# EAGLE design ACC_GYRO_SENSOR (EAGLE 7.1.0)
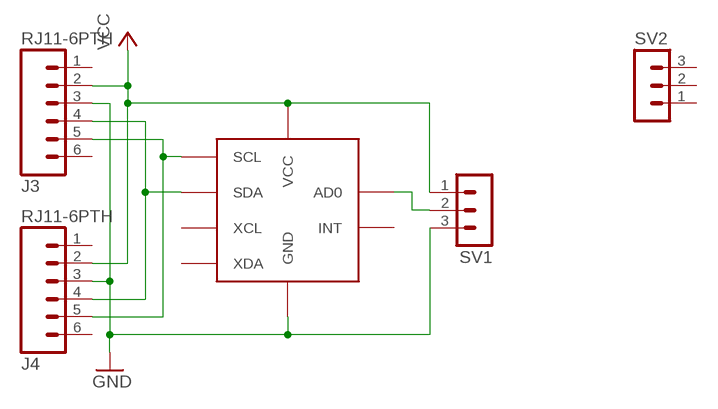
[diagram p0: schematic, sheet 1]

## Parts
J3  RJ11-6PTH  [RJ11-6]
J4  RJ11-6PTH  [RJ11-6]
SV1  MA03-1  [MA03-1]
SV2  MA03-1  [MA03-1]
U$1  GY-521  [GY-521]

## Nets
GND: J3.3 J4.3 SV1.3 U$1.GND
N$1: J3.4 J4.4 U$1.SDA
N$2: J3.5 J4.5 U$1.SCL
N$4: SV1.2 U$1.AD0
VCC: J3.2 J4.2 SV1.1 U$1.VCC
Unconnected: J3.1 J3.6 J4.1 J4.6 SV2.1 SV2.2 SV2.3 U$1.INT U$1.XCL U$1.XDA

## Library data of the parts
J3 J4 = BodyRockParts:RJ11-6: RJ11 Jack Simple 6 pin RJ11 jack. Commonly found on CAT3 devices and Microchip programmers. SKU: PRT-00132
SV1 SV2 = con-lstb:MA03-1: PIN HEADER; OC_FARNELL: unknown; OC_NEWARK: unknown
U$1 = GY-521:GY-521: MPU5060 Breakout Board -Standard pin header footprint

## Board
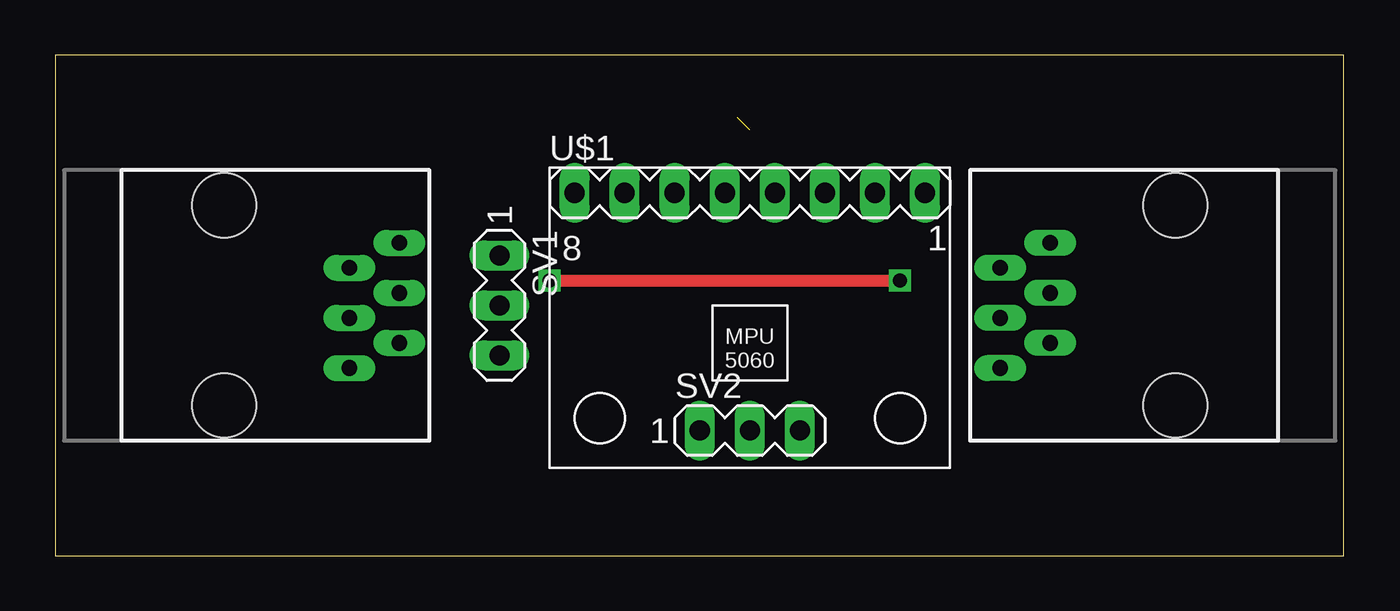
[diagram p1: board, top side]
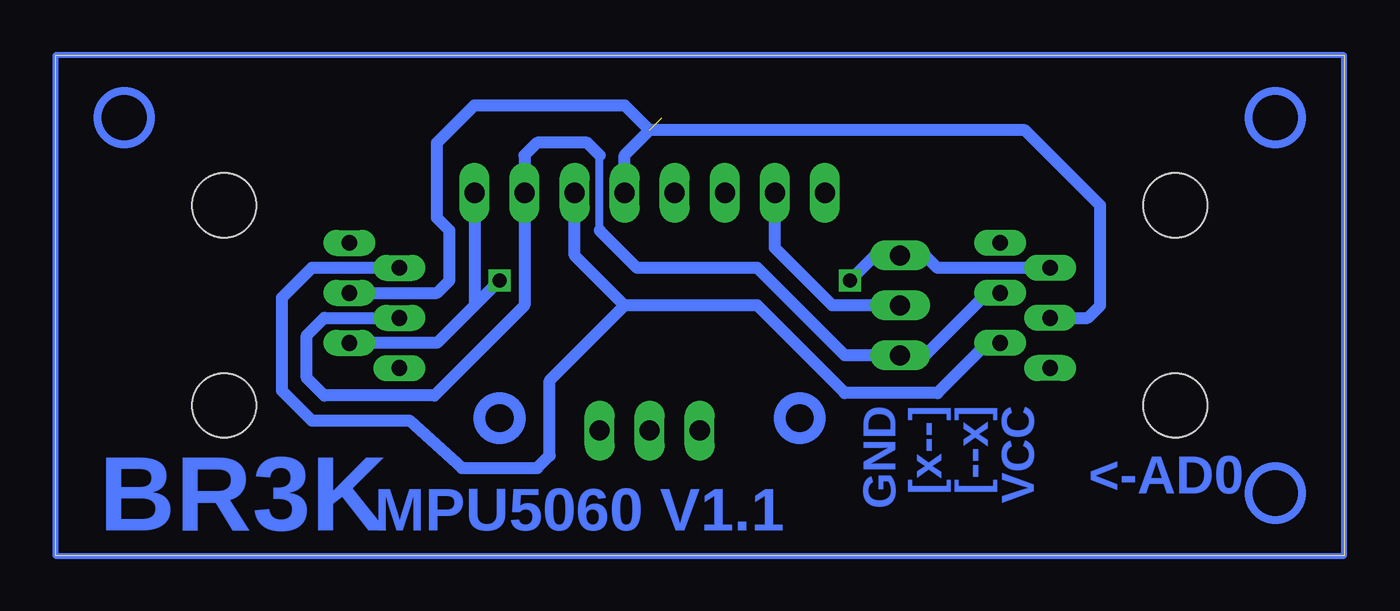
[diagram p2: board, bottom side, seen from below]

Size 65.39 x 25.39 mm. Coordinates in mm from the lower left corner, seen from the top.
Outline: 0,0 65.39,0 65.39,25.39 0,25.39 0,0
Copper layers (1*16): Top 0.035mm / dielectric 1.5mm / Bottom 0.035mm
Design rules "default *": minimum track width 10mil, minimum drill 24mil, track to track 12mil, track to pad 12mil, pad to pad 12mil, via to via 12mil, smd to smd 12mil, copper to edge 40mil, drill to drill 8mil, minimum pad ring 10mil, minimum via ring 8mil, stop-mask expansion 4mil, vias tented up to drill 0mil, thermal gap 10mil

### Footprints (pad centres in the part's own frame; a part is rotated, then mirrored left to right if it is on the bottom)
RJ11-6 = drill 0.8 long: 1 1.905,8.89; 2 3.175,6.35; 3 4.445,8.89; 4 5.715,6.35; 5 6.985,8.89; 6 8.255,6.35 | hole 3.251: 0,0; 10.16,0
MA03-1 = drill 1.016 long: 1 -2.54,0; 2 0,0; 3 2.54,0
GY-521 = drill 1.016 long: AD0 -6.35,0; GND 6.35,0; INT -8.89,0; SCL 3.81,0; SDA 1.27,0; VCC 8.89,0; XCL -3.81,0; XDA -1.27,0

### Placement (x,y rotation side)
J3  8.57,17.78 270 top
J4  56.83,7.62 90 top
SV1  22.54,12.7 270 top
SV2  35.24,6.35 0 top
U$1  35.24,18.41 0 top

### Tracks (layer width: path | path; a pad name or v marks a point on that pad's centre or on a via)
GND
  Bottom 0.406: 37.78,16.51 37.78,20.32
  Bottom 0.61: J3.3 18.1,13.34 21.27,10.16 SV1.3 25.34,10.16 29.78,14.6 35.88,14.6 37.78,16.51 | J4.3 51.75,12.06 52.64,11.18 52.64,9.02 51.75,8.13 46.16,8.13 41.59,12.7 U$1.GND 41.59,20.32 40.96,20.95 38.42,20.95 37.78,20.32
N$1  (1 unrouted)
  Bottom 0.61: J4.4 46.04,13.34 45.4,13.97 45.4,16.51 46.04,17.14 46.04,20.95 44.13,22.86 36.51,22.86 35.24,21.59 | J3.4 13.02,12.06 12.38,12.7 12.38,17.78 16.19,21.59 35.24,21.59 | U$1.SDA 36.51,20.32 35.24,21.59
N$2
  Bottom 0.61: J4.5 52.39,14.6 53.91,13.08 53.91,8.38 52.39,6.86 47.43,6.86 44.77,4.44 40.96,4.44 40.32,5.08 40.32,8.89 36.51,12.7 | J3.5 18.1,10.8 20.64,8.25 25.34,8.25 29.78,12.7 36.51,12.7 | 36.51,12.7 39.05,15.24 U$1.SCL
N$3
  Bottom 0.305: 0,25.4 65.4,25.4 65.4,0 0,0 0,25.4
N$4
  Bottom 0.61: SV1.2 25.97,12.7 28.89,15.62 U$1.AD0
VCC  (via drill 0.7)
  Top 0.61: v25.08,13.97 v42.86,13.97
  Bottom 0.61: J3.2 20.64,14.6 21.27,15.24 SV1.1 23.81,15.24 v25.08,13.97 | U$1.VCC 44.13,12.7 | 44.13,12.7 46.04,10.8 J4.2 | v42.86,13.97 44.13,12.7
(copper drawn outside any net)
  shapes: Bottom circle x9

### Text on the board
Bottom: GND / [x--] / [--x] / VCC | <-AD0 | MPU5060 V1.1 | BR3K